# EAGLE schematic interface_dac_sma_feedback_3PS_ADC_detector (EAGLE 7.2.0)
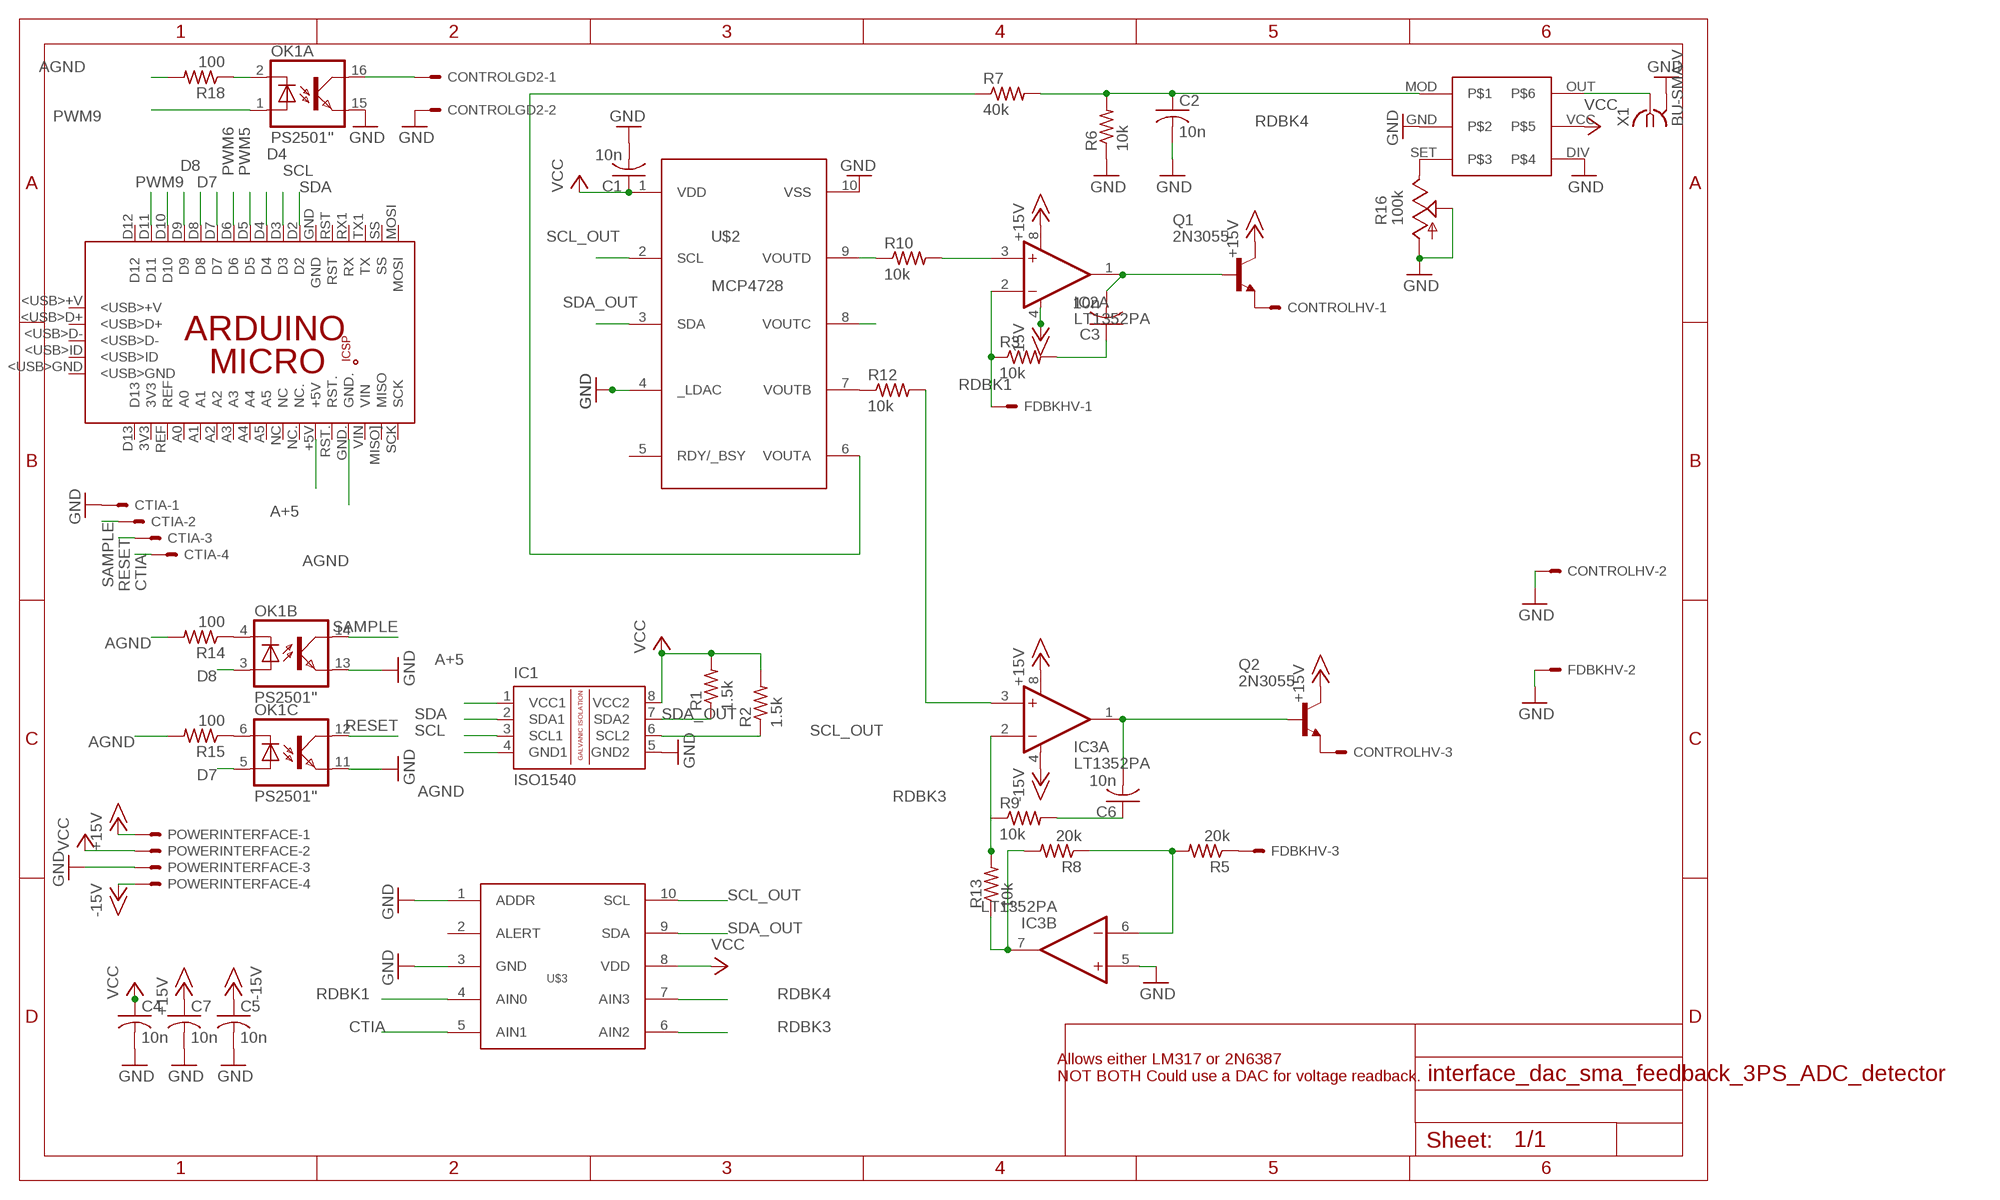
[diagram p0: schematic, sheet 1]

## Parts
C1  10n  C-US050-024X044  [C050-024X044]
C2  10n  C-US050-024X044  [C050-024X044]
C3  10n  C-US050-024X044  [C050-024X044]
C4  10n  C-US050-024X044  [C050-024X044]
C5  10n  C-US050-024X044  [C050-024X044]
C6  10n  C-US050-024X044  [C050-024X044]
C7  10n  C-US050-024X044  [C050-024X044]
CONTROLGD2  KK-156-2  [KK-156-2]
CONTROLHV  KK-156-3  [KK-156-3]
CTIA  KK-156-4  [KK-156-4]
FDBKHV  KK-156-3  [KK-156-3]
IC1  ISO1540  [DIL08]
IC2  LT1352PA  [DIL08]
IC3  LT1352PA  [DIL08]
OK1  PS2501"  [DIL16]
PCB1  ARDUINO_MICRO  [ARDUINO_MICRO]
POWERINTERFACE  KK-156-4  [KK-156-4]
Q1  2N3055  [TO3]
Q2  2N3055  [TO3]
R1  1.5k  R-US_0207/12  [0207/12]
R2  1.5k  R-US_0207/12  [0207/12]
R3  10k  R-US_0207/12  [0207/12]
R5  20k  R-US_0207/12  [0207/12]
R6  10k  R-US_0207/12  [0207/12]
R7  40k  R-US_0207/12  [0207/12]
R8  20k  R-US_0207/12  [0207/12]
R9  10k  R-US_0207/12  [0207/12]
R10  10k  R-US_0207/12  [0207/12]
R12  10k  R-US_0207/12  [0207/12]
R13  10k  R-US_0207/12  [0207/12]
R14  100  R-US_0207/12  [0207/12]
R15  100  R-US_0207/12  [0207/12]
R16  100k  TRIM_US-B90P  [SP19L]
R18  100  R-US_0207/12  [0207/12]
U$1  LTC6992  [DIL06]
U$2  MCP4728DIL  [DIL10]
U$3  ADS1015DIL  [DIL10]
X1  BU-SMA-V  [BU-SMA-V]

## Nets
+15V: C7.1 IC2.8(A:V+) IC3.8(A:V+) POWERINTERFACE.1 Q1.C Q1.C/(C) Q2.C Q2.C/(C)
-15V: C5.1 IC2.4(A:V-) IC3.4(A:V-) POWERINTERFACE.4
A+5: IC1.1(VCC1) PCB1.+5V
AGND: IC1.4(GND1) PCB1.GND. R14.2 R15.2 R18.2
CTIA: CTIA.4 U$3.5(AIN1)
D4: PCB1.D4
D7: OK1.5(C:A) PCB1.D7
D8: OK1.3(B:A) PCB1.D8
D10: PCB1.D10
D11: PCB1.D11
ENSW2: CONTROLGD2.1 OK1.16(A:COL)
GND: C1.2 C2.2 C4.2 C5.2 C7.2 CONTROLGD2.2 CONTROLHV.2 CTIA.1 FDBKHV.2 IC1.5(GND2) IC3.5(B:+IN) OK1.11(C:EMI) OK1.13(B:EMI) OK1.15(A:EMI) POWERINTERFACE.3 R6.1 R16.A R16.S U$1.DIV U$1.GND U$2.4(_LDAC) U$2.10(VSS) U$3.1(ADDR) U$3.3(GND) X1.2 X1.3 X1.4 X1.5
N$1: R7.1 U$2.6(VOUTA)
N$2: OK1.4(B:C) R14.1
N$3: C3.1 R3.2
N$4: CONTROLHV.1 Q1.E
N$5: CONTROLHV.3 Q2.E
N$6: OK1.6(C:C) R15.1
N$7: OK1.2(A:C) R18.1
N$8: FDBKHV.3 R5.1
N$12: R16.E U$1.SET
N$13: U$1.OUT X1.1
N$14: IC3.7(B:OUT) R8.2 R13.1
N$16: IC2.3(A:+IN) R10.2
N$18: IC3.3(A:+IN) R12.2
N$19: C3.2 IC2.1(A:OUT) Q1.B
N$20: C6.1 R9.2
N$21: C6.2 IC3.1(A:OUT) Q2.B
N$23: IC3.6(B:-IN) R5.2 R8.1
N$24: R10.1 U$2.9(VOUTD)
N$25: R12.1 U$2.7(VOUTB)
N$26: U$2.8(VOUTC)
PWM5: PCB1.D5
PWM6: PCB1.D6
PWM9: OK1.1(A:A) PCB1.D9
RDBK1: FDBKHV.1 IC2.2(A:-IN) R3.1 U$3.4(AIN0)
RDBK3: IC3.2(A:-IN) R9.1 R13.2 U$3.6(AIN2)
RDBK4: C2.1 R6.2 R7.2 U$1.MOD U$3.7(AIN3)
RESET: CTIA.3 OK1.12(C:COL)
SAMPLE: CTIA.2 OK1.14(B:COL)
SCL: IC1.3(SCL1) PCB1.D3
SCL_OUT: IC1.6(SCL2) R2.1 U$2.2(SCL) U$3.10(SCL)
SDA: IC1.2(SDA1) PCB1.D2
SDA_OUT: IC1.7(SDA2) R1.1 U$2.3(SDA) U$3.9(SDA)
VCC: C1.1 C4.1 IC1.8(VCC2) POWERINTERFACE.2 R1.2 R2.2 U$1.VCC U$2.1(VDD) U$3.8(VDD)
Unconnected: IC2.5(B:+IN) IC2.6(B:-IN) IC2.7(B:OUT) OK1.7(D:A) OK1.8(D:C) OK1.9(D:EMI) OK1.10(D:COL) PCB1.3V3 PCB1.5V PCB1.<USB>+V PCB1.<USB>D+ PCB1.<USB>D- PCB1.<USB>GND PCB1.<USB>ID PCB1.A0 PCB1.A1 PCB1.A2 PCB1.A3 PCB1.A4 PCB1.A5 PCB1.D12 PCB1.D13 PCB1.GND PCB1.GND_ PCB1.MISO. PCB1.MISO](MISO) PCB1.MOSI PCB1.MOSI. PCB1.NC PCB1.NC. PCB1.REF PCB1.RESET.. PCB1.RST PCB1.RST. PCB1.RX1(RX) PCB1.SCK PCB1.SCK. PCB1.SS PCB1.TX1(TX) PCB1.VIN U$2.5(RDY/_BSY) U$3.2(ALERT)

## Notes on the sheet
- Allows either LM317 or 2N6387
  NOT BOTH Could use a DAC for voltage readback.

## Library data of the parts
C1 = rcl:C-US: CAPACITOR, American symbol
C2-C7 = resistor:C-US: CAPACITOR, American symbol
CONTROLGD2 = con-molex:KK-156-2: KK 156 HEADER Source: http://www.molex.com/pdm_docs/sd/026604100_sd.pdf; OC_FARNELL: unknown; OC_NEWARK: unknown
CONTROLHV FDBKHV = con-molex:KK-156-3: KK 156 HEADER Source: http://www.molex.com/pdm_docs/sd/026604100_sd.pdf; OC_FARNELL: unknown; OC_NEWARK: unknown
CTIA POWERINTERFACE = con-molex:KK-156-4: KK 156 HEADER Source: http://www.molex.com/pdm_docs/sd/026604100_sd.pdf; OC_FARNELL: unknown; OC_NEWARK: unknown
IC1 = texas:ISO1540: ISOLATED CAN TRANSCEIVER Source: http://focus.ti.com/lit/ds/symlink/iso1050.pdf
IC2 IC3 = linear-technology:LT1352: Dual Operational Amplifiers Source: http://datasheets.maxim-ic.com/en/ds/ICL7612-ICL764X.pdf; OC_FARNELL: unknown; OC_NEWARK: unknown
OK1 = optocoupler:PS2501: SHARP OPTO COUPLER
PCB1 = E14_Arduino_published:ARDUINO_MICRO: Device for representing an Arduino Micro board with a footprint in an EAGLE design. Created by Dave Young for Element14. More EAGLE documentation at: http://www.element14.com/community/community/knode/cadsoft_eagle
Q1 Q2 = transistor-npn:2N3055: NPN Transistor
R1-R3 R5-R10 R12 R13 = resistor:R-US_: RESISTOR, American symbol
R14 R15 R18 = rcl:R-US_: RESISTOR, American symbol
R16 = pot:TRIM_US-: POTENTIOMETER
U$1 = linear-technology:LTC6992
U$2 = microchip:MCP4728
U$3 = texas:ADS1015
X1 = con-coax:BU-SMA-V: FEMALE SMA CONNECTOR Radiall distributor RS 112-3794; OC_FARNELL: unknown; OC_NEWARK: unknown